# EAGLE design PR8002 (EAGLE 6.6.0)
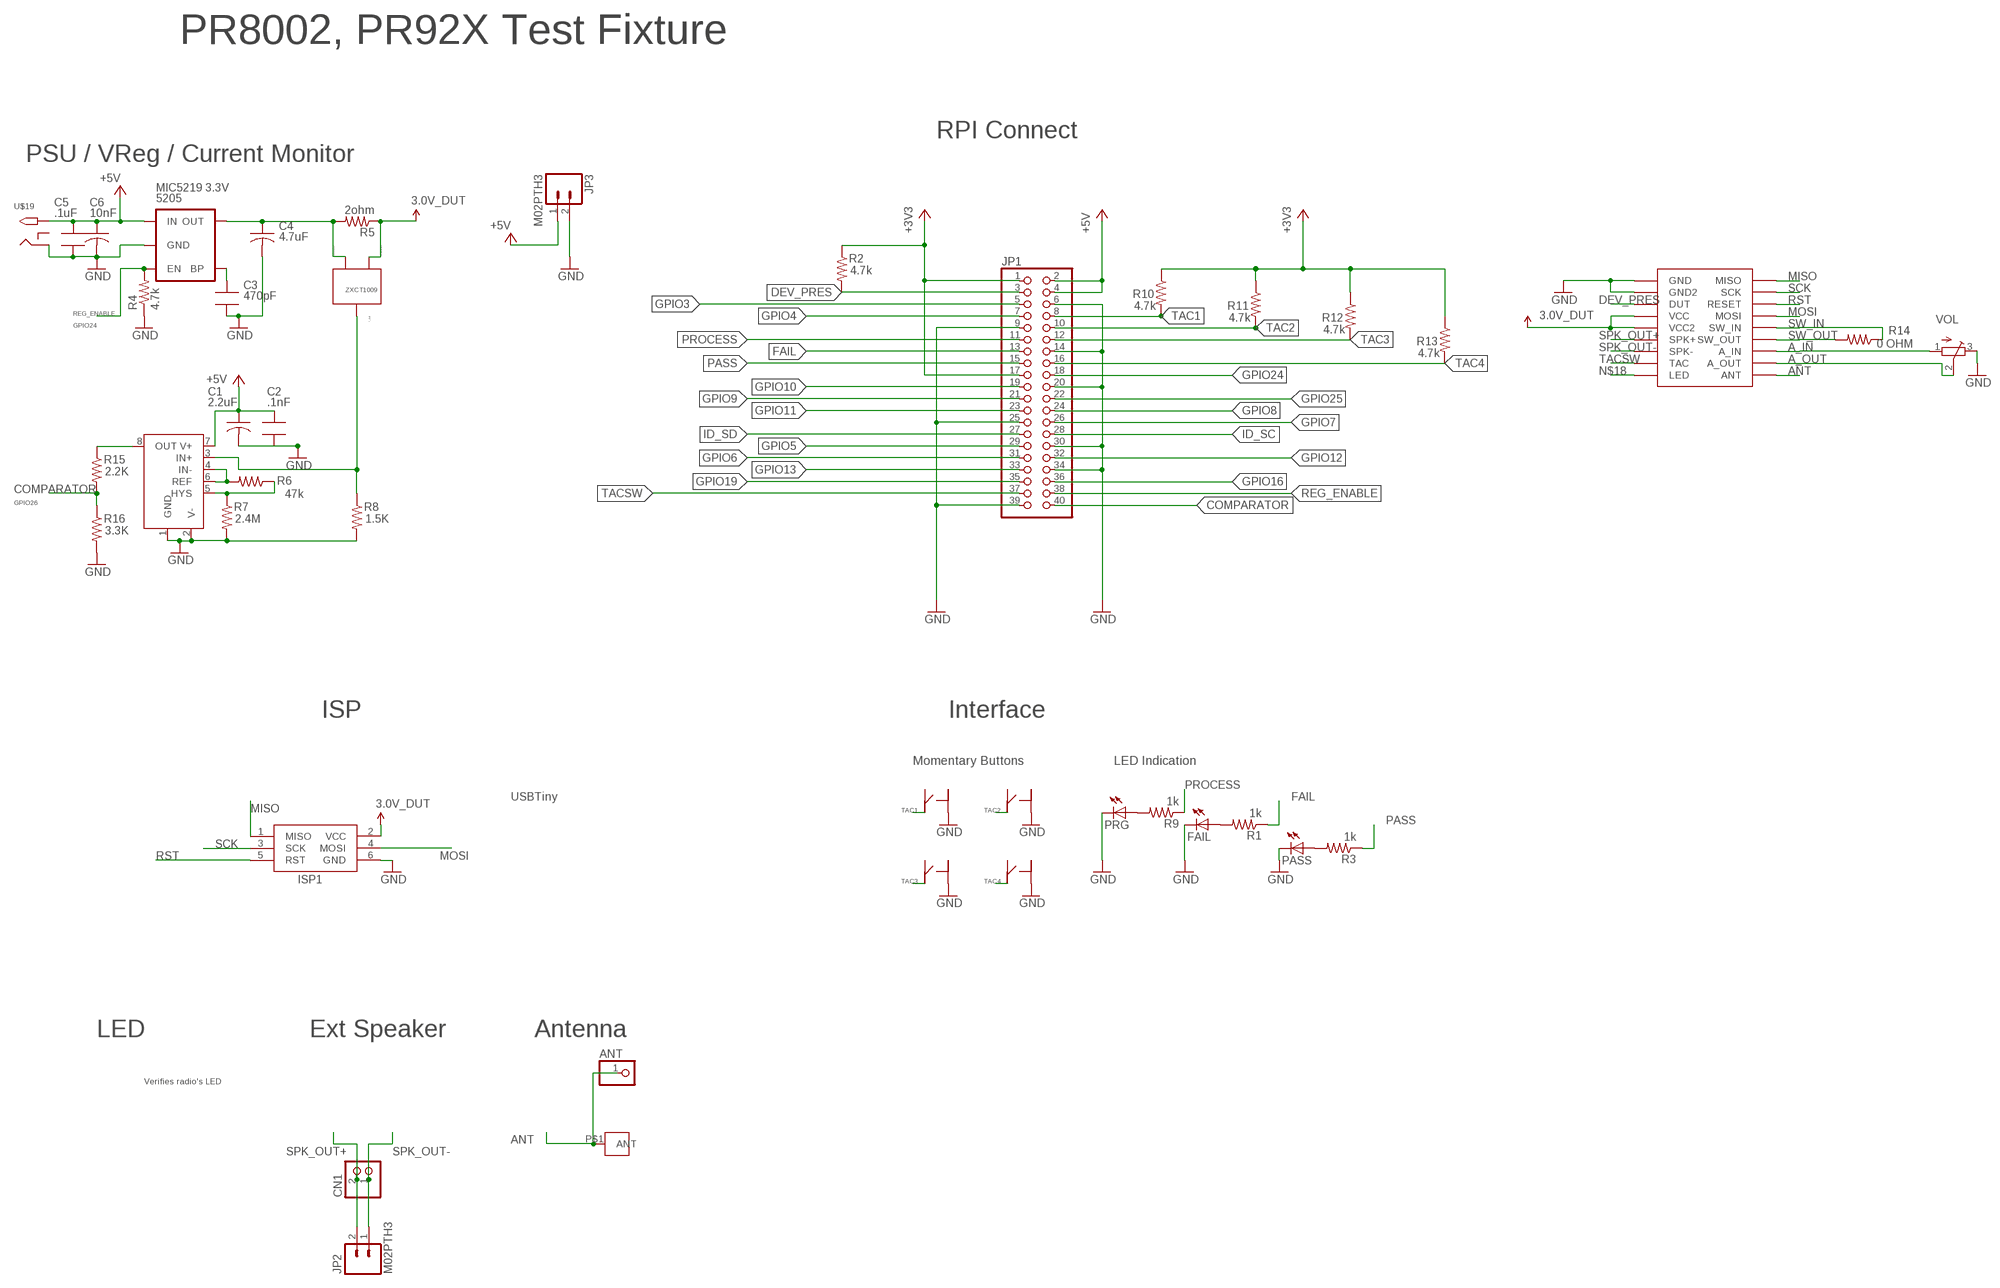
[diagram p0: schematic, sheet 1]

## Parts
5205  MIC5219 3.3V  V_REG_MIC52193.3V  [SOT23-5]
ANT  PINHD-1X1  [1X01]
C1  2.2uF  C-USC0805  [C0805]
C2  .1nF  C_SMT_0805_ADAFRUIT  [0805_ADAFRUIT]
C3  470pF  C_SMT_0805_ADAFRUIT  [0805_ADAFRUIT]
C4  4.7uF  C-USC0805  [C0805]
C5  .1uF  C_SMT_0805_ADAFRUIT  [0805_ADAFRUIT]
C6  10nF  C-USC0805  [C0805]
CN1  JST_2PIN-SMT-RA  [JST-B2B-PH-SM4-TB]
FAIL  LEDCHIP-LED0805  [CHIP-LED0805]
ISP1  AVRISP-6  [AVRISP]
J1  M3_SCREW_POST  [M3_BOLT_HOLE]
JP1  PINHD-2X20  [2X20]
JP2  M02PTH3  [1X02_LONGPADS]
JP3  M02PTH3  [1X02_LONGPADS]
PASS  LEDCHIP-LED0805  [CHIP-LED0805]
PRG  LEDCHIP-LED0805  [CHIP-LED0805]
R1  1k  R_SMT_0805_ADAFRUIT  [0805_ADAFRUIT]
R2  4.7k  R_SMT_0805_ADAFRUIT  [0805_ADAFRUIT]
R3  1k  R_SMT_0805_ADAFRUIT  [0805_ADAFRUIT]
R4  4.7k  R_SMT_0805_ADAFRUIT  [0805_ADAFRUIT]
R5  2ohm  R_SMT_0805_ADAFRUIT  [0805_ADAFRUIT]
R6  47k  R_SMT_0805_ADAFRUIT  [0805_ADAFRUIT]
R7  2.4M  R_SMT_0805_ADAFRUIT  [0805_ADAFRUIT]
R8  1.5K  R_SMT_0805_ADAFRUIT  [0805_ADAFRUIT]
R9  1k  R_SMT_0805_ADAFRUIT  [0805_ADAFRUIT]
R10  4.7k  R_SMT_0805_ADAFRUIT  [0805_ADAFRUIT]
R11  4.7k  R_SMT_0805_ADAFRUIT  [0805_ADAFRUIT]
R12  4.7k  R_SMT_0805_ADAFRUIT  [0805_ADAFRUIT]
R13  4.7k  R_SMT_0805_ADAFRUIT  [0805_ADAFRUIT]
R14  0 OHM  R_SMT_0805_ADAFRUIT  [0805_ADAFRUIT]
R15  2.2K  R_SMT_0805_ADAFRUIT  [0805_ADAFRUIT]
R16  3.3K  R_SMT_0805_ADAFRUIT  [0805_ADAFRUIT]
TSM931  TSM931  [MSOP8]
U$19  2.1MMJACKTHM  [PJ-102A]
U$20  C&K_PTS645  [C&K_PTS645_SMT]
U$22  C&K_PTS645  [C&K_PTS645_SMT]
U$23  C&K_PTS645  [C&K_PTS645_SMT]
U$24  C&K_PTS645  [C&K_PTS645_SMT]
U$26  PR9020_TESTPOINTS  [PR9020_TESTPOINTS]
VOL  TRIMPOTTC33X  [TC33X]
ZXCT  ZXCT1009  [SOT23]

## Nets
3.3V: ISP1.2(VCC) R5.1 U$26.P$4(VCC) U$26.P$5(VCC2) ZXCT.1(VSENSE+) ; supply symbol labelled 3.0V_DUT
+3V3: JP1.1 JP1.17 R2.1 R10.1 R11.1 R12.1 R13.1
+5V: 5205.1(IN) C1.1 C2.1 C5.1 C6.1 JP1.2 JP1.4 JP3.1 TSM931.7(V+) U$19.TIP
A_IN: U$26.P$16(A_IN) VOL.1(A)
A_OUT: U$26.P$17(A_OUT) VOL.2(S)
ANT: ANT.1 J1.P$1(ANT) U$26.P$18(ANT)
COMPARATOR: JP1.40 R15.2 R16.1
DEV_PRES: JP1.3 R2.2 U$26.P$3(DUT)
FAIL: JP1.13 R1.1
GND: 5205.2(GND) C1.2 C2.2 C3.2 C4.2 C5.2 C6.2 FAIL.C ISP1.6(GND) JP1.6 JP1.9 JP1.14 JP1.20 JP1.25 JP1.30 JP1.34 JP1.39 JP3.2 PASS.C PRG.C R4.1 R7.2 R8.2 R16.2 TSM931.1(GND) TSM931.2(V-) U$19.RING U$20.P$2 U$22.P$2 U$23.P$2 U$24.P$2 U$26.P$1(GND) U$26.P$2(GND2) VOL.3(E)
GPIO3: JP1.5
GPIO4: JP1.7
GPIO5: JP1.29
GPIO6: JP1.31
GPIO7: JP1.26
GPIO8: JP1.24
GPIO9: JP1.21
GPIO10: JP1.19
GPIO11: JP1.23
GPIO12: JP1.32
GPIO13: JP1.33
GPIO16: JP1.36
GPIO19: JP1.35
GPIO24: JP1.18
GPIO25: JP1.22
ID_SC: JP1.28
ID_SD: JP1.27
MISO: ISP1.1(MISO) U$26.P$10(MISO)
MOSI: ISP1.4(MOSI) U$26.P$13(MOSI)
N$1: R6.2 TSM931.4(IN-) TSM931.6(REF)
N$2: PRG.A R9.2
N$3: FAIL.A R1.2
N$4: PASS.A R3.2
N$6: R15.1 TSM931.8(OUT)
N$12: R8.1 TSM931.3(IN+) ZXCT.3(IOUT)
N$13: 5205.4(BP) C3.1
N$14: 5205.5(OUT) C4.1 R5.2 ZXCT.2(VSENSE-)
N$15: R6.1 R7.1 TSM931.5(HYS)
N$18: U$26.P$9(LED)
PASS: JP1.15 R3.1
PROCESS: JP1.11 R9.1
REG_ENABLE: 5205.3(EN) JP1.38 R4.2
RST: ISP1.5(RST) U$26.P$12(RESET)
SCK: ISP1.3(SCK) U$26.P$11(SCK)
SPK_OUT+: CN1.2 JP2.2 U$26.P$6(SPK+)
SPK_OUT-: CN1.1 JP2.1 U$26.P$7(SPK-)
SW_IN: R14.2 U$26.P$14(SW_IN)
SW_OUT: R14.1 U$26.P$15(SW_OUT)
TAC1: JP1.8 R10.2 U$20.P$4
TAC2: JP1.10 R11.2 U$23.P$4
TAC3: JP1.12 R12.2 U$22.P$4
TAC4: JP1.16 R13.2 U$24.P$4
TACSW: JP1.37 U$26.P$8(TAC)
Unconnected: U$19.RING_SW U$20.P$1 U$20.P$3 U$22.P$1 U$22.P$3 U$23.P$1 U$23.P$3 U$24.P$1 U$24.P$3

## Notes on the sheet
- PR8002, PR92X Test Fixture
- RPI Connect
- PSU / VReg / Current Monitor
- ZXCT1009
- GPIO24
- GPIO26
- ISP | Interface
- Momentary Buttons | LED Indication
- USBTiny
- LED | Ext Speaker | Antenna
- Verifies radio's LED

## Library data of the parts
5205 = SparkFun-PowerIC:V_REG_MIC5219: V_REG MIC5219 Standard 3.3V and 5V 500mA LDO voltage regulator in SOT-23 layout. Micrel part MIC5219. BP (by-pass) pin is used to lower output noise with 470pF cap, may be left open.; PROD_ID: VREG-5205-3.0
ANT = adafruit:PINHD-1X1: Pin header 1x1 for 0.1" spacing With round pins
C1 C4 C6 = adafruit:C-US: CAPACITOR, American symbol
C2 C3 C5 = PR_Parts_Library:C_SMT: SMT capacitor
CN1 = PR_Parts_Library:JST_2PIN: JST 2-pin connector; MFG_PN: B2B-PH-SM4-TB(LF)(SN)
FAIL PASS PRG = adafruit:LED: LED OSRAM: - CHIPLED LG R971, LG N971, LY N971, LG Q971, LY Q971, LO R971, LY R971 LH N974, LH R974 LS Q976, LO Q976, LY Q976 LO Q996 - Hyper CHIPLED LW Q18S LB Q993, LB Q99A, LB R99A - SideLED LS A670, LO A670, LY A670, LG A670, LP A670 LB A673, LV A673, LT A673, LW A673 LH A674 LY A675 LS A676, LA A676, LO A676, LY A676, LW A676 LS A679, LY A679, LG A679 - Hyper Micro SIDELED® LS Y876, LA Y876, LO Y876, LY Y876 LT Y87S - SmartLED LW L88C, LW L88S LB L89C, LB L89S, LG L890 LS L89K, LO L89K, LY L89K LS L896, LA L896, LO L896, LY L896 - TOPLED LS T670, LO T670, LY T670, LG T670, LP T670 LSG T670, LSP T670, LSY T670, LOP T670, LYG T670 LG T671, LOG T671, LSG T671 LB T673, LV T673, LT T673, LW T673 LH T674 LS T676, LA T676, LO T676, LY T676, LB T676, LH T676, LSB T676, LW T676 LB T67C, LV T67C, LT T67C, LS T67K, LO T67K, LY T67K, LW E67C LS E67B, LA E67B, LO E67B, LY E67B, LB E67C, LV E67C, LT E67C LW T67C LS T679, LY T679, LG T679 LS T770, LO T770, LY T770, LG T770, LP T770 LB T773, LV T773, LT T773, LW T773 LH T774 LS E675, LA E675, LY E675, LS T675 LS T776, LA T776, LO T776, LY T776, LB T776 LHGB T686 LT T68C, LB T68C - Hyper Mini TOPLED® LB M676 - Mini TOPLED Santana® LG M470 LS M47K, LO M47K, LY M47K Source: http://www.osram.convergy.de/
ISP1 = adafruit:AVRISP: AVR ISP HEADER Standard 6 pin header for AVR programming
J1 = PR_Parts_Library:M3_SCREW_POST: Antenna mounting hole for M3 screw.; MFG_PN: DNP
JP1 = adafruit:PINHD-2X20: PIN HEADER
JP2 JP3 = SparkFun-Connectors:M02: Standard 2-pin 0.1" header. Use with - straight break away headers ( PRT-00116) - right angle break away headers (PRT-00553) - swiss pins (PRT-00743) - machine pins (PRT-00117) - female headers (PRT-00115) Molex polarized connector foot print use with: PRT-08233 with associated crimp pins and housings. 2.54_SCREWTERM for use with PRT-10571. 3.5mm Screw Terminal footprints for PRT-08084 5mm Screw Terminal footprints for use with PRT-08432
R1-R4 R6 R7 R9-R16 = PR_Parts_Library:R_SMT: SMT resistor
R5 = PR_Parts_Library:R_SMT: SMT resistor; POWER: .5W; TOL: 1%
R8 = PR_Parts_Library:R_SMT: SMT resistor; TOL: 1%
TSM931 = PR_Parts_Library:TSM931
U$19 = adafruit:2.1MMJACK: 2.1mm x 5.5mm THM DC jack with internal switch. Digikey part #PJ-102A, 4UCON part #05537 2.1mm x 5.5mm SMT DC jack with internal switch. Digikey part #PJ-002A-SMT, 4UCON part #03267 By microbuilder.eu & adafruit.com
U$20 U$22-U$24 = PR_Parts_Library:C&K_PTS645: SWITCH TACTILE SPST-NO 0.05A 12V; MFG_PN: PTS645SM43SMTR92 LFS
U$26 = PR_Parts_Library:PR9020_TESTPOINTS
VOL = adafruit:TRIMPOT: SMT trimmer potentiometer part number TC33X http://www.ladyada.net/library/eagle
ZXCT = PR_Parts_Library:ZXCT1009

## Net classes
1 antenna: clearance 1.27 mm

## Board
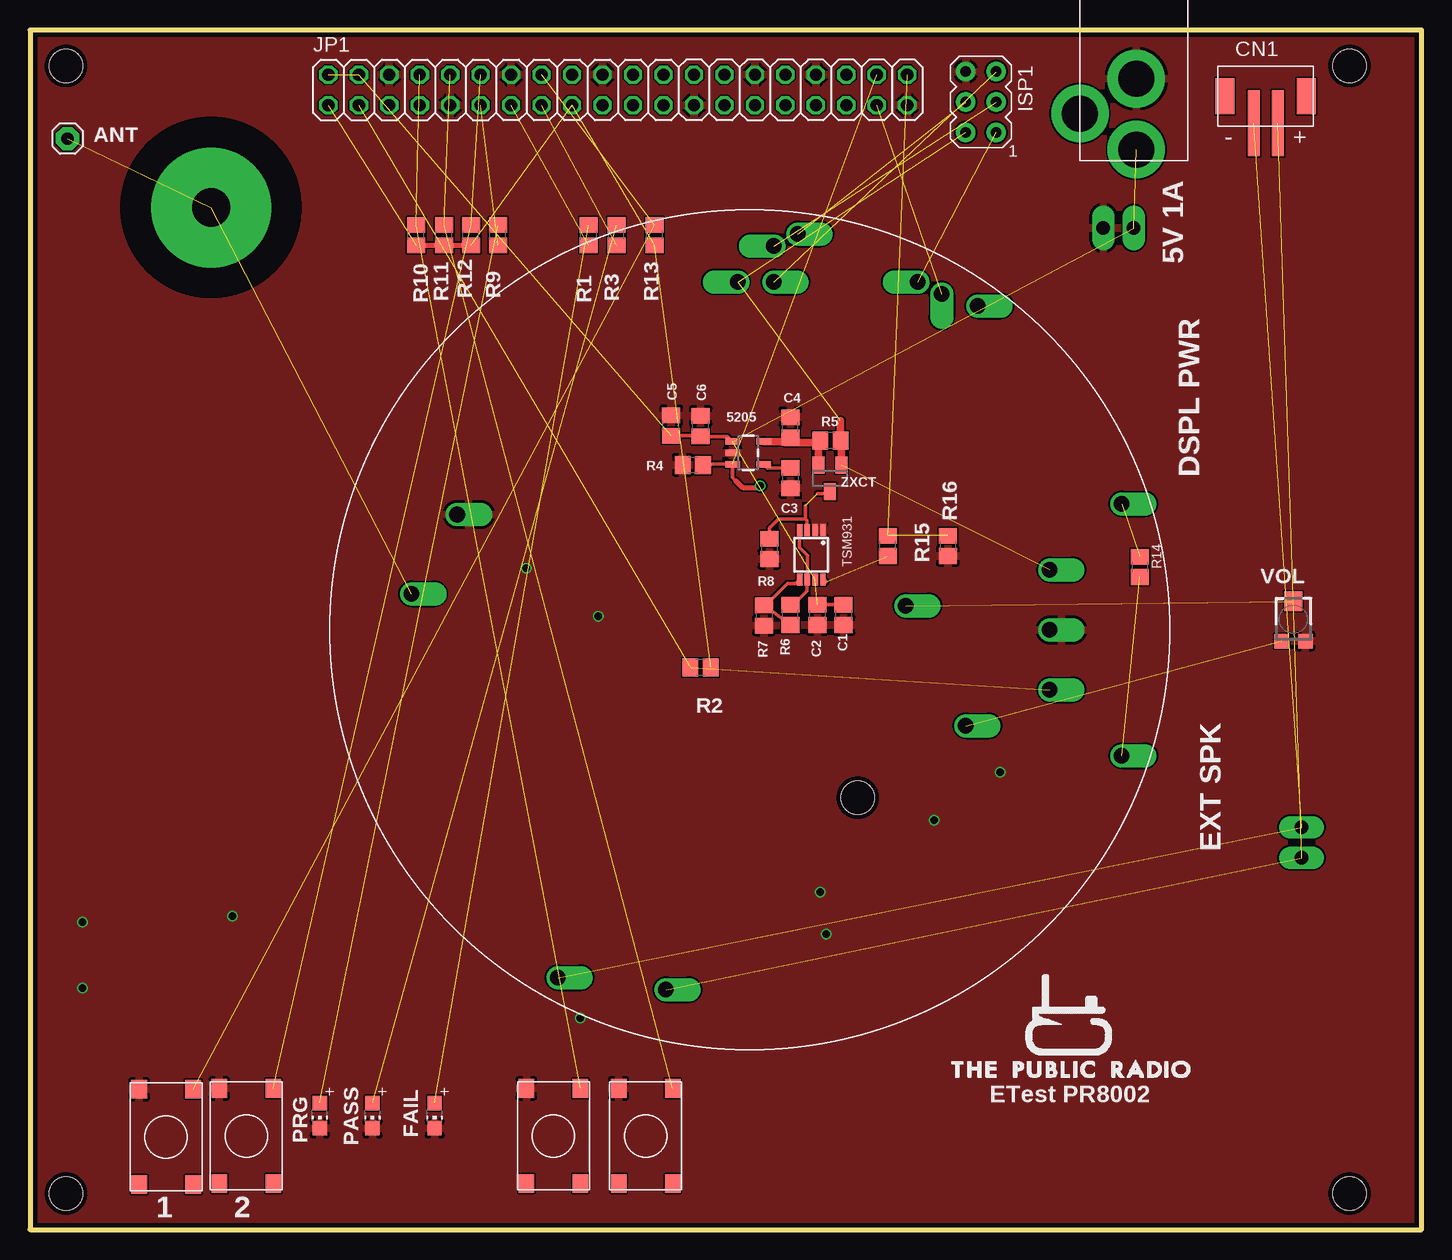
[diagram p1: board, top side]
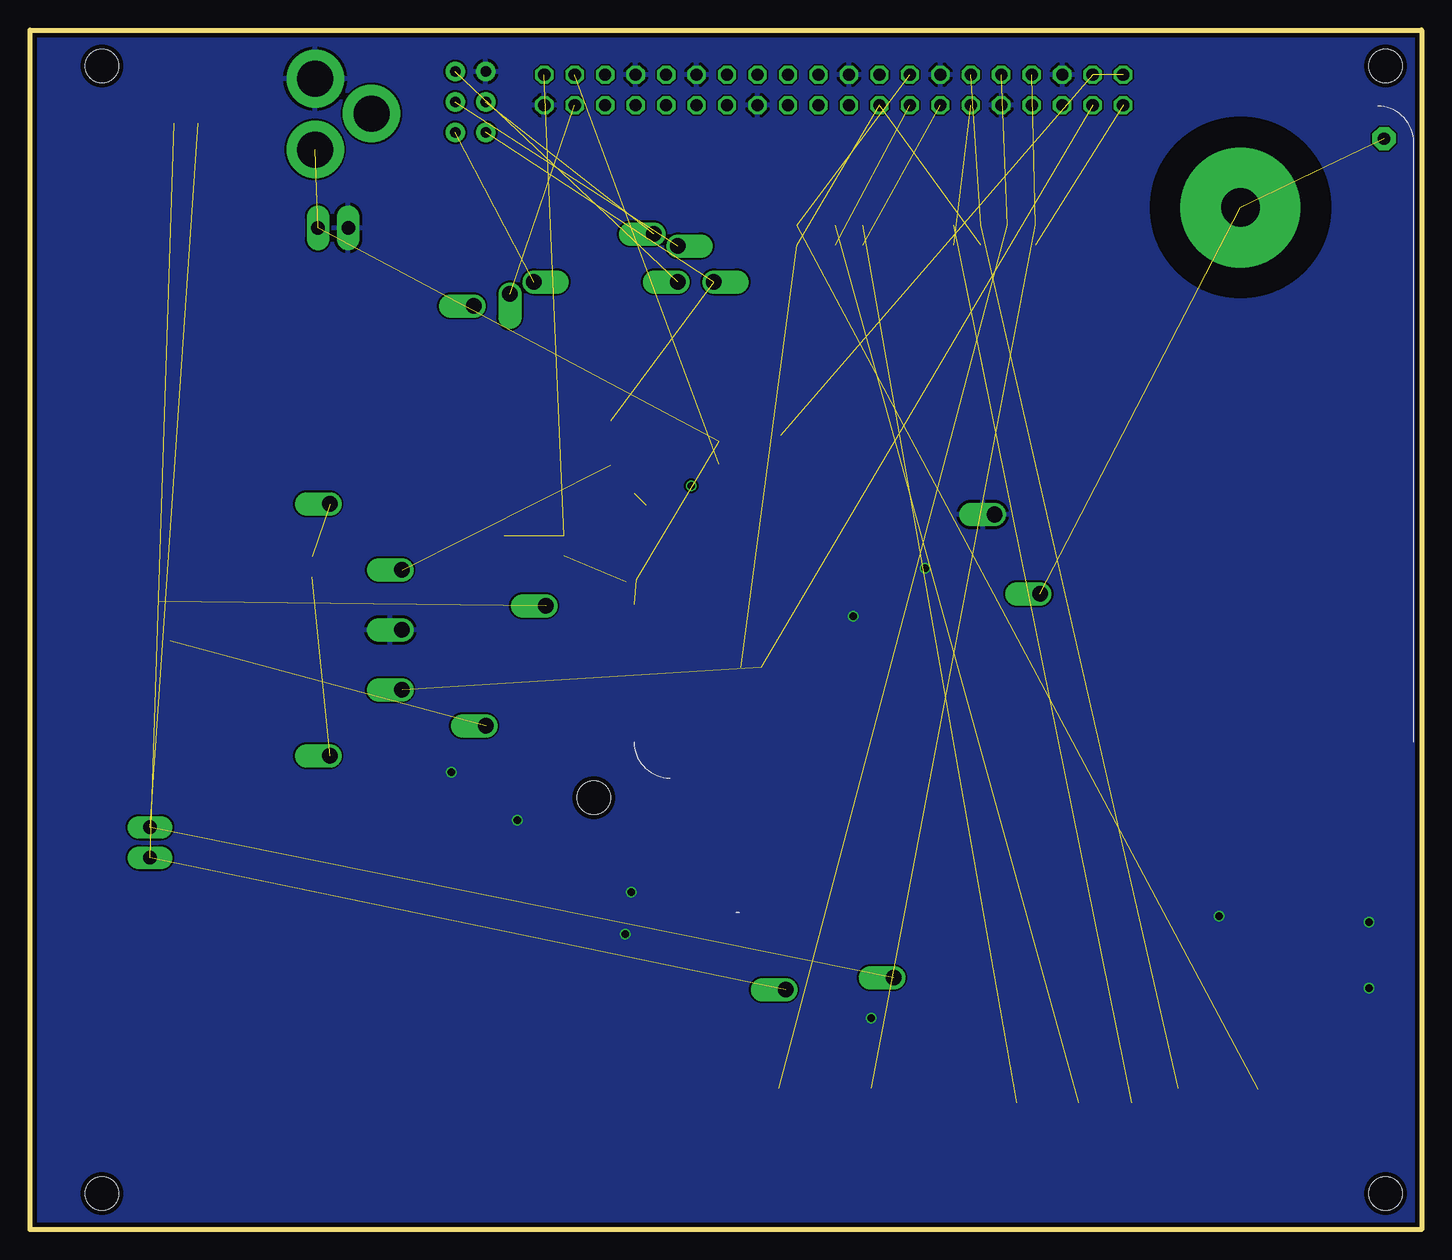
[diagram p2: board, bottom side, seen from below]

Size 116 x 100 mm. Coordinates in mm from the lower left corner, seen from the top.
Outline: 0,0 116,0 116,100 0,100 0,0
Copper layers (1*16): Top 0.0356mm / dielectric 1.5011mm / Bottom 0.0356mm
Design rules "LaenPCBOrder *": minimum track width 6mil, minimum drill 13mil, track to track 6mil, track to pad 6mil, pad to pad 6mil, via to via 6mil, smd to smd 6mil, copper to edge 15mil, drill to drill 6mil, minimum pad ring 7mil, minimum via ring 5mil, stop-mask expansion 3mil, vias tented up to drill 0mil, thermal gap 10mil
Holes 2.75 mm at 3,3 3,97 110,97 69,36 110,3

### Footprints (pad centres in the part's own frame; a part is rotated, then mirrored left to right if it is on the bottom)
SOT23-5 = smd 0.55 x 1.2: 1 -0.95,-1.3; 2 0,-1.3; 3 0.95,-1.3; 4 0.95,1.3; 5 -0.95,1.3
1X01 = drill 1.016 pad 1.93 octagon: 1 0,0
C0805 = smd 1.3 x 1.5: 1 -0.85,0; 2 0.85,0
0805_ADAFRUIT = smd 1.3 x 1.5: 1 -0.85,0; 2 0.85,0
JST-B2B-PH-SM4-TB = smd 1 x 5.5: 1 1,-2.75; 2 -1,-2.75 | smd 1.6 x 3: NC1 -3.4,-0.5; NC2 3.4,-0.5
CHIP-LED0805 = smd 1.2 x 1.2: A 0,-1.05; C 0,1.05
AVRISP = drill 0.9 pad 1.626: 1 -1.27,2.54; 2 1.27,2.54; 3 -1.27,0; 4 1.27,0; 5 -1.27,-2.54; 6 1.27,-2.54
M3_BOLT_HOLE = drill 3.2 pad 10: P$1 0,0
2X20 = drill 1.016 octagon: 1 -24.13,-1.27; 2 -24.13,1.27; 3 -21.59,-1.27; 4 -21.59,1.27; 5 -19.05,-1.27; 6 -19.05,1.27; 7 -16.51,-1.27; 8 -16.51,1.27; 9 -13.97,-1.27; 10 -13.97,1.27; 11 -11.43,-1.27; 12 -11.43,1.27; 13 -8.89,-1.27; 14 -8.89,1.27; 15 -6.35,-1.27; 16 -6.35,1.27; 17 -3.81,-1.27; 18 -3.81,1.27; 19 -1.27,-1.27; 20 -1.27,1.27; 21 1.27,-1.27; 22 1.27,1.27; 23 3.81,-1.27; 24 3.81,1.27; 25 6.35,-1.27; 26 6.35,1.27; 27 8.89,-1.27; 28 8.89,1.27; 29 11.43,-1.27; 30 11.43,1.27; 31 13.97,-1.27; 32 13.97,1.27; 33 16.51,-1.27; 34 16.51,1.27; 35 19.05,-1.27; 36 19.05,1.27; 37 21.59,-1.27; 38 21.59,1.27; 39 24.13,-1.27; 40 24.13,1.27
1X02_LONGPADS = drill 1.118 pad 1.88 long: 1 0,0; 2 2.54,0
MSOP8 = smd 0.45 x 1: 1 -0.975,-2.05; 2 -0.325,-2.05; 3 0.325,-2.05; 4 0.975,-2.05; 5 0.975,2.05; 6 0.325,2.05; 7 -0.325,2.05; 8 -0.975,2.05
PJ-102A = drill 3 pad 4.8: RING 0.1,-3.39; RING_SW -4.6,-6.29; TIP 0.1,-9.29
C&K_PTS645_SMT = smd 1.55 x 1.3: P$1 -3.975,2.25; P$2 3.975,2.25; P$3 -3.975,-2.25; P$4 3.975,-2.25
PR9020_TESTPOINTS = drill 1.3 pad 1.3 offset: P$1 10.6,44.6; P$2 60,35; P$3 60,30; P$4 60,40; P$5 34,64; P$6 19,6; P$7 28,5; P$8 51,63; P$9 54,62; P$10 49,64; P$11 37,67; P$12 37,64; P$13 39,68; P$14 66,24.5; P$15 66,45.5; P$16 53,27; P$17 48,37; P$18 6.8,38
TC33X = smd 1.2 x 1.2: 1 -1,-1.825; 3 1,-1.825 | smd 1.5 x 1.6: 2 0,1.5
SOT23 = smd 1 x 1.4: 1 -0.95,-1.1; 2 0.95,-1.1; 3 0,1.1

### Placement (x,y rotation side)
5205  59.88,64.75 270 top
ANT  3.12,90.95 0 top
C1  67.83,51.25 270 top
C2  65.62,51.25 270 top
C3  63.38,62.65 270 top
C4  63.38,66.88 90 top
C5  53.45,67.03 90 top
C6  55.9,66.97 90 top
CN1  103,95 0 top
FAIL  33.73,9.5 180 top
ISP1  79.28,94 180 top
J1  15.1,85.2 0 top
JP1  49,95 0 top
JP2  106,31 90 top
JP3  92,83.5 180 top
PASS  28.55,9.5 180 top
PRG  24.15,9.5 180 top
R1  46.58,82.9 90 top
R2  55.9,46.85 180 top
R3  48.88,82.9 90 top
R4  55.25,63.75 0 top
R5  66.72,65.78 180 top
R6  63.38,51.25 90 top
R7  61.17,51.2 270 top
R8  61.62,56.75 270 top
R9  39,82.9 90 top
R10  32.2,82.9 90 top
R11  34.52,82.9 90 top
R12  36.75,82.9 90 top
R13  52.05,82.9 90 top
R14  92.5,55.25 270 top
R15  71.5,57 90 top
R16  76.5,57 270 top
TSM931  65.12,56.25 180 top
U$1  [PR_LOGO]  86.58,18.23 0 top
U$19  92.12,99.33 0 top
U$20  43.62,7.8 90 top
U$22  18.02,7.8 90 top
U$23  51.33,7.8 90 top
U$24  11.35,7.72 90 top
U$26  25,15 0 top
VOL  105.33,50.88 0 top
ZXCT  66.67,62.62 180 top

### Tracks (layer width: path | path; a pad name or v marks a point on that pad's centre or on a via)
3.3V  (3 unrouted)
  Top 0.305: 67.33,65.53 R5.1
  Top 0.406: 67.88,65.62 R5.1 67.25,65.65
  Top 0.61: 67.58,67.42 R5.1 67.62,65.72 ZXCT.1
+3V3  (4 unrouted)
  Top 0.406: R10.1 R11.1 R12.1
+5V  (6 unrouted)
  Top 0.305: C2.1 C1.1 | C5.1 55.85,66.17 C6.1 58.15,66.12 5205.1
  Top 0.61: 68.17,51.75 C1.1
A_IN  (1 unrouted)
A_OUT  (1 unrouted)
ANT  (2 unrouted)
COMPARATOR  (2 unrouted)
DEV_PRES  (2 unrouted)
FAIL  (1 unrouted)
GND  (via drill 0.6)
  other vias: 4.38,25.62 66.38,24.62 65.88,28.12 80.88,38.12 75.38,34.12 4.38,20.12 47.38,51.12 41.38,55.12 16.88,26.12 45.88,17.62
  pour Top: 0,100 116,100 116,0 0,0
  pour Bottom: 0,0 116,0 116,100 0,100
MISO  (1 unrouted)
MOSI  (1 unrouted)
N$1
  Top 0.305: TSM931.4 64.12,58.27 64.12,56.88 64.8,56.2 TSM931.6 64.75,54.15 64.75,53.25 63.62,52.12 R6.2
N$2  (1 unrouted)
N$3  (1 unrouted)
N$4  (1 unrouted)
N$6  (1 unrouted)
  Top 0.406: 66.3,54 TSM931.8
N$12  (1 unrouted)
  Top 0.305: 61.48,57.75 R8.1 61.62,58.5 62.38,59.25 64.62,59.25 | 64.62,59.25 64.75,59.12 64.75,58.35 TSM931.3 | 64.62,59.25 64.62,60.38 | 65.62,61.38 66.22,61.38 ZXCT.3
N$13
  Top 0.305: 61.48,63.85 5205.4 61.48,63.5 C3.1
N$14
  Top 0.305: 63.77,65.62 C4.1 63.05,65.7
  Top 0.61: 5205.5 62.88,65.7 | 62.88,65.7 63.05,65.7 | 65.72,65.62 62.95,65.62 62.88,65.7 | ZXCT.2 65.72,65.62 | 65.72,65.62 R5.2
N$15
  Top 0.305: TSM931.5 63.83,53.88 63.12,53.88 61.62,52.38 R7.1 R6.1
N$21
  pour Bottom: 
PASS  (1 unrouted)
PROCESS  (1 unrouted)
REG_ENABLE  (via drill 0.6)  (1 unrouted)
  Top 0.305: 56.15,63.8 5205.3 58.58,62.67 58.83,62.42
  Top 0.406: 56.15,63.8 R4.2 | 58.83,62.42 59.38,61.88 60.75,61.88 v60.88,62
RST  (1 unrouted)
SCK  (1 unrouted)
SPK_OUT+  (2 unrouted)
SPK_OUT-  (2 unrouted)
SW_IN  (1 unrouted)
SW_OUT  (1 unrouted)
TAC1  (2 unrouted)
TAC2  (2 unrouted)
TAC3  (2 unrouted)
TAC4  (2 unrouted)
TACSW  (1 unrouted)

### Text on the board
tPlace: EXT SPK | 1 | 2
tNames: 5V 1A | DSPL PWR | ETest PR8002